# EAGLE schematic OOBDpiCAN (EAGLE 7.2.0)

## Sheet 1 of 3
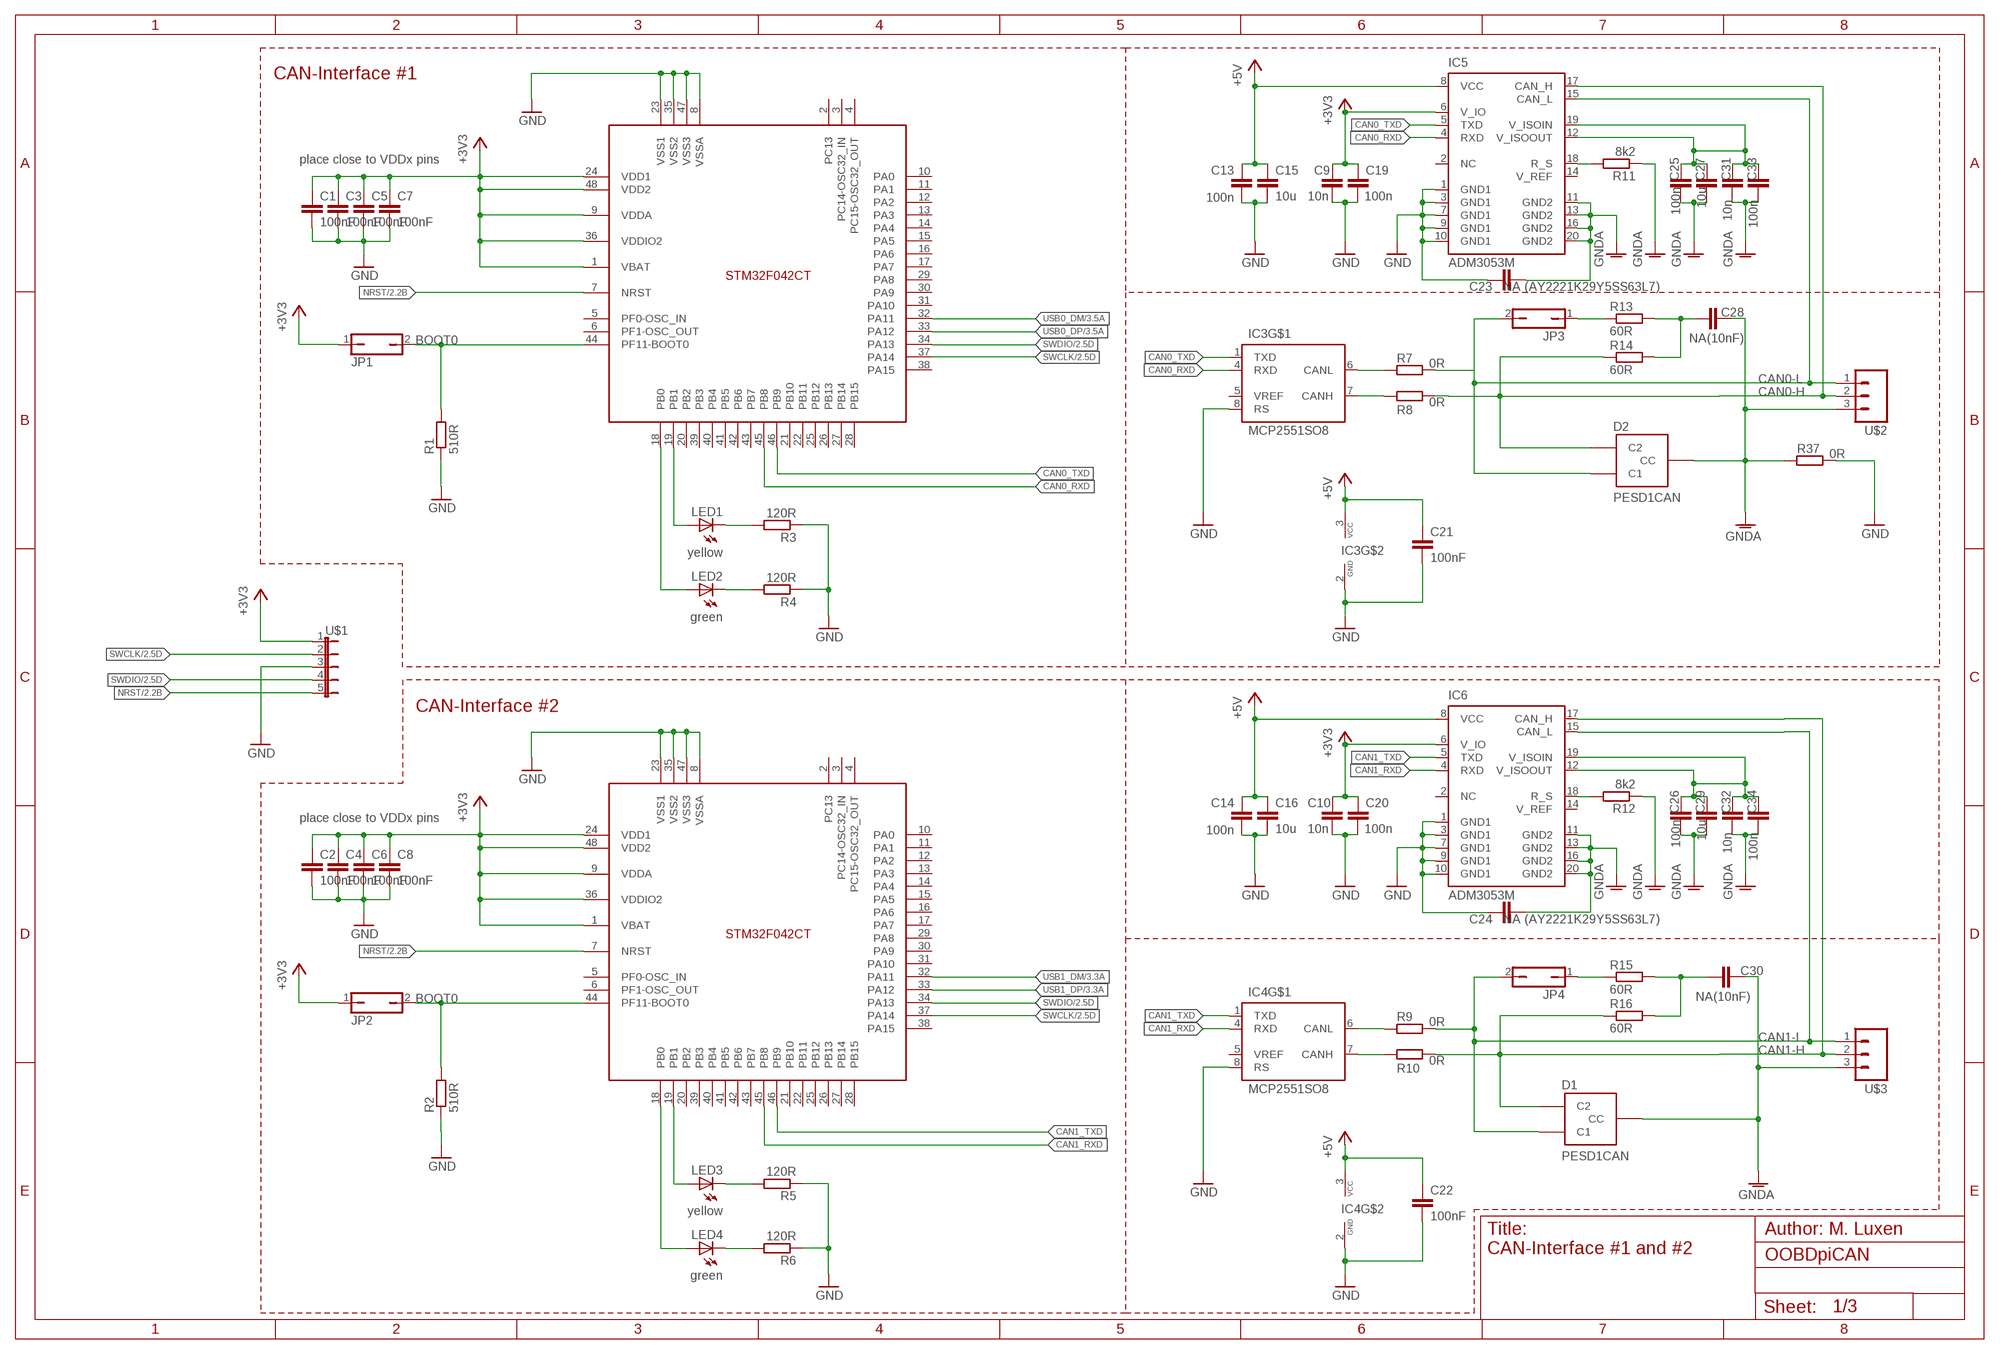
[diagram p0: schematic, sheet 1]

### Parts
C1  100nF  C-EUC0603  [C0603]
C2  100nF  C-EUC0603  [C0603]
C3  100nF  C-EUC0603  [C0603]
C4  100nF  C-EUC0603  [C0603]
C5  100nF  C-EUC0603  [C0603]
C6  100nF  C-EUC0603  [C0603]
C7  100nF  C-EUC0603  [C0603]
C8  100nF  C-EUC0603  [C0603]
C9  10n  C-EUC0603K  [C0603K]
C10  10n  C-EUC0603K  [C0603K]
C13  100n  C-EUC0603K  [C0603K]
C14  100n  C-EUC0603K  [C0603K]
C15  10u  C-EUC0805K  [C0805K]
C16  10u  C-EUC0805K  [C0805K]
C19  100n  C-EUC0603K  [C0603K]
C20  100n  C-EUC0603K  [C0603K]
C21  100nF  C-EUC0603  [C0603]
C22  100nF  C-EUC0603  [C0603]
C23  NA (AY2221K29Y5SS63L7)  C-EU075-032X103  [C075-032X103]
C24  NA (AY2221K29Y5SS63L7)  C-EU075-032X103  [C075-032X103]
C25  100n  C-EUC0805K  [C0805K]
C26  100n  C-EUC0805K  [C0805K]
C27  10u  C-EUC0805K  [C0805K]
C28  NA(10nF)  C-EUC0603  [C0603]
C29  10u  C-EUC0805K  [C0805K]
C30  NA(10nF)  C-EUC0603  [C0603]
C31  10n  C-EUC0805K  [C0805K]
C32  10n  C-EUC0805K  [C0805K]
C33  100n  C-EUC0805K  [C0805K]
C34  100n  C-EUC0805K  [C0805K]
D1  PESD1CAN  [SOT23]
D2  PESD1CAN  [SOT23]
IC1  STM32F042CT  [LQFP48]
IC2  STM32F042CT  [LQFP48]
IC3  MCP2551SO8  [SO08]
IC4  MCP2551SO8  [SO08]
IC5  ADM3053M  [SO20W]
IC6  ADM3053M  [SO20W]
JP1  JP1Q  [JP1]
JP2  JP1Q  [JP1]
JP3  JP1Q  [JP1]
JP4  JP1Q  [JP1]
LED1  yellow  LEDCHIPLED_0805  [CHIPLED_0805]
LED2  green  LEDCHIPLED_0805  [CHIPLED_0805]
LED3  yellow  LEDCHIPLED_0805  [CHIPLED_0805]
LED4  green  LEDCHIPLED_0805  [CHIPLED_0805]
R1  510R  R-EU_R0603  [R0603]
R2  510R  R-EU_R0603  [R0603]
R3  120R  R-EU_R0603  [R0603]
R4  120R  R-EU_R0603  [R0603]
R5  120R  R-EU_R0603  [R0603]
R6  120R  R-EU_R0603  [R0603]
R7  0R  R-EU_0207/10  [0207/10]
R8  0R  R-EU_0207/10  [0207/10]
R9  0R  R-EU_0207/10  [0207/10]
R10  0R  R-EU_0207/10  [0207/10]
R11  8k2  R-EU_R0603  [R0603]
R12  8k2  R-EU_R0603  [R0603]
R13  60R  R-EU_R0603  [R0603]
R14  60R  R-EU_R0603  [R0603]
R15  60R  R-EU_R0603  [R0603]
R16  60R  R-EU_R0603  [R0603]
R37  0R  R-EU_0207/10  [0207/10]
U$1  JP5E  [JP5]
U$2  M03  [SCREWTERMINAL-3.5MM-3]
U$3  M03  [SCREWTERMINAL-3.5MM-3]

### Nets
+3V3: C1.1 C2.1 C3.1 C4.1 C5.1 C6.1 C7.1 C8.1 C9.1 C10.1 C19.1 C20.1 IC1.1(VBAT) IC1.9(VDDA) IC1.24(VDD1) IC1.36(VDDIO2) IC1.48(VDD2) IC2.1(VBAT) IC2.9(VDDA) IC2.24(VDD1) IC2.36(VDDIO2) IC2.48(VDD2) IC5.6(V_IO) IC6.6(V_IO) JP1.1 JP2.1 U$1.1 ; also sheet 2,3
+5V: C13.1 C14.1 C15.1 C16.1 C21.1 C22.1 IC3.3(VCC) IC4.3(VCC) IC5.8(VCC) IC6.8(VCC) ; also sheet 2,3
BOOT0: IC1.44(PF11-BOOT0) IC2.44(PF11-BOOT0) JP1.2 JP2.2 R1.2 R2.2 ; also sheet 2
CAN0-H: D2.2(C2) IC5.17(CAN_H) R8.2 R14.1 U$2.2
CAN0-L: D2.1(C1) IC5.15(CAN_L) JP3.2 R7.2 U$2.1
CAN0_RXD: IC1.45(PB8) IC3.4(RXD) IC5.4(RXD)
CAN0_TXD: IC1.46(PB9) IC3.1(TXD) IC5.5(TXD)
CAN1-H: D1.2(C2) IC6.17(CAN_H) R10.2 R16.1 U$3.2
CAN1-L: D1.1(C1) IC6.15(CAN_L) JP4.2 R9.2 U$3.1
CAN1_RXD: IC2.45(PB8) IC4.4(RXD) IC6.4(RXD)
CAN1_TXD: IC2.46(PB9) IC4.1(TXD) IC6.5(TXD)
GND: C1.2 C2.2 C3.2 C4.2 C5.2 C6.2 C7.2 C8.2 C9.2 C10.2 C13.2 C14.2 C15.2 C16.2 C19.2 C20.2 C21.2 C22.2 C23.1 C24.1 IC1.8(VSSA) IC1.23(VSS1) IC1.35(VSS2) IC1.47(VSS3) IC2.8(VSSA) IC2.23(VSS1) IC2.35(VSS2) IC2.47(VSS3) IC3.2(GND) IC3.8(RS) IC4.2(GND) IC4.8(RS) IC5.1(GND1) IC5.3(GND1) IC5.7(GND1) IC5.9(GND1) IC5.10(GND1) IC6.1(GND1) IC6.3(GND1) IC6.7(GND1) IC6.9(GND1) IC6.10(GND1) R1.1 R2.1 R3.1 R4.1 R5.1 R6.1 R37.2 U$1.3 ; also sheet 2,3
GNDA: C23.2 C24.2 C25.2 C26.2 C27.2 C28.2 C29.2 C30.2 C31.2 C32.2 C33.2 C34.2 D1.3(CC) D2.3(CC) IC5.11(GND2) IC5.13(GND2) IC5.16(GND2) IC5.20(GND2) IC6.11(GND2) IC6.13(GND2) IC6.16(GND2) IC6.20(GND2) R11.1 R12.1 R37.1 U$2.3 U$3.3
N$1: IC5.18(R_S) R11.2
N$12: IC6.18(R_S) R12.2
N$13: C26.1 C29.1 C32.1 C34.1 IC6.12(V_ISOOUT) IC6.19(V_ISOIN)
N$14: IC3.6(CANL) R7.1
N$19: IC3.7(CANH) R8.1
N$22: IC1.19(PB1) LED1.A
N$23: IC1.18(PB0) LED2.A
N$24: LED1.C R3.2
N$25: LED2.C R4.2
N$26: IC4.7(CANH) R10.1
N$27: IC4.6(CANL) R9.1
N$28: JP4.1 R15.1
N$29: IC2.19(PB1) LED3.A
N$30: IC2.18(PB0) LED4.A
N$31: LED3.C R5.2
N$32: LED4.C R6.2
N$48: JP3.1 R13.1
N$49: C30.1 R15.2 R16.2
N$53: C28.1 R13.2 R14.2
N$65: C25.1 C27.1 C31.1 C33.1 IC5.12(V_ISOOUT) IC5.19(V_ISOIN)
NRST: IC1.7(NRST) IC2.7(NRST) U$1.5 ; also sheet 2
SWCLK: IC1.37(PA14) IC2.37(PA14) U$1.2 ; also sheet 2
SWDIO: IC1.34(PA13) IC2.34(PA13) U$1.4 ; also sheet 2
USB0_DM: IC1.32(PA11) ; also sheet 3
USB0_DP: IC1.33(PA12) ; also sheet 3
USB1_DM: IC2.32(PA11) ; also sheet 3
USB1_DP: IC2.33(PA12) ; also sheet 3
Unconnected: IC1.2(PC13) IC1.3(PC14-OSC32_IN) IC1.4(PC15-OSC32_OUT) IC1.5(PF0-OSC_IN) IC1.6(PF1-OSC_OUT) IC1.10(PA0) IC1.11(PA1) IC1.12(PA2) IC1.13(PA3) IC1.14(PA4) IC1.15(PA5) IC1.16(PA6) IC1.17(PA7) IC1.20(PB2) IC1.21(PB10) IC1.22(PB11) IC1.25(PB12) IC1.26(PB13) IC1.27(PB14) IC1.28(PB15) IC1.29(PA8) IC1.30(PA9) IC1.31(PA10) IC1.38(PA15) IC1.39(PB3) IC1.40(PB4) IC1.41(PB5) IC1.42(PB6) IC1.43(PB7) IC2.2(PC13) IC2.3(PC14-OSC32_IN) IC2.4(PC15-OSC32_OUT) IC2.5(PF0-OSC_IN) IC2.6(PF1-OSC_OUT) IC2.10(PA0) IC2.11(PA1) IC2.12(PA2) IC2.13(PA3) IC2.14(PA4) IC2.15(PA5) IC2.16(PA6) IC2.17(PA7) IC2.20(PB2) IC2.21(PB10) IC2.22(PB11) IC2.25(PB12) IC2.26(PB13) IC2.27(PB14) IC2.28(PB15) IC2.29(PA8) IC2.30(PA9) IC2.31(PA10) IC2.38(PA15) IC2.39(PB3) IC2.40(PB4) IC2.41(PB5) IC2.42(PB6) IC2.43(PB7) IC3.5(VREF) IC4.5(VREF) IC5.2(NC) IC5.14(V_REF) IC6.2(NC) IC6.14(V_REF)

### Notes on the sheet
- CAN-Interface #1
- place close to VDDx pins
- CAN-Interface #2
- place close to VDDx pins
- Title: | Author: M. Luxen
- CAN-Interface #1 and #2

## Sheet 2 of 3
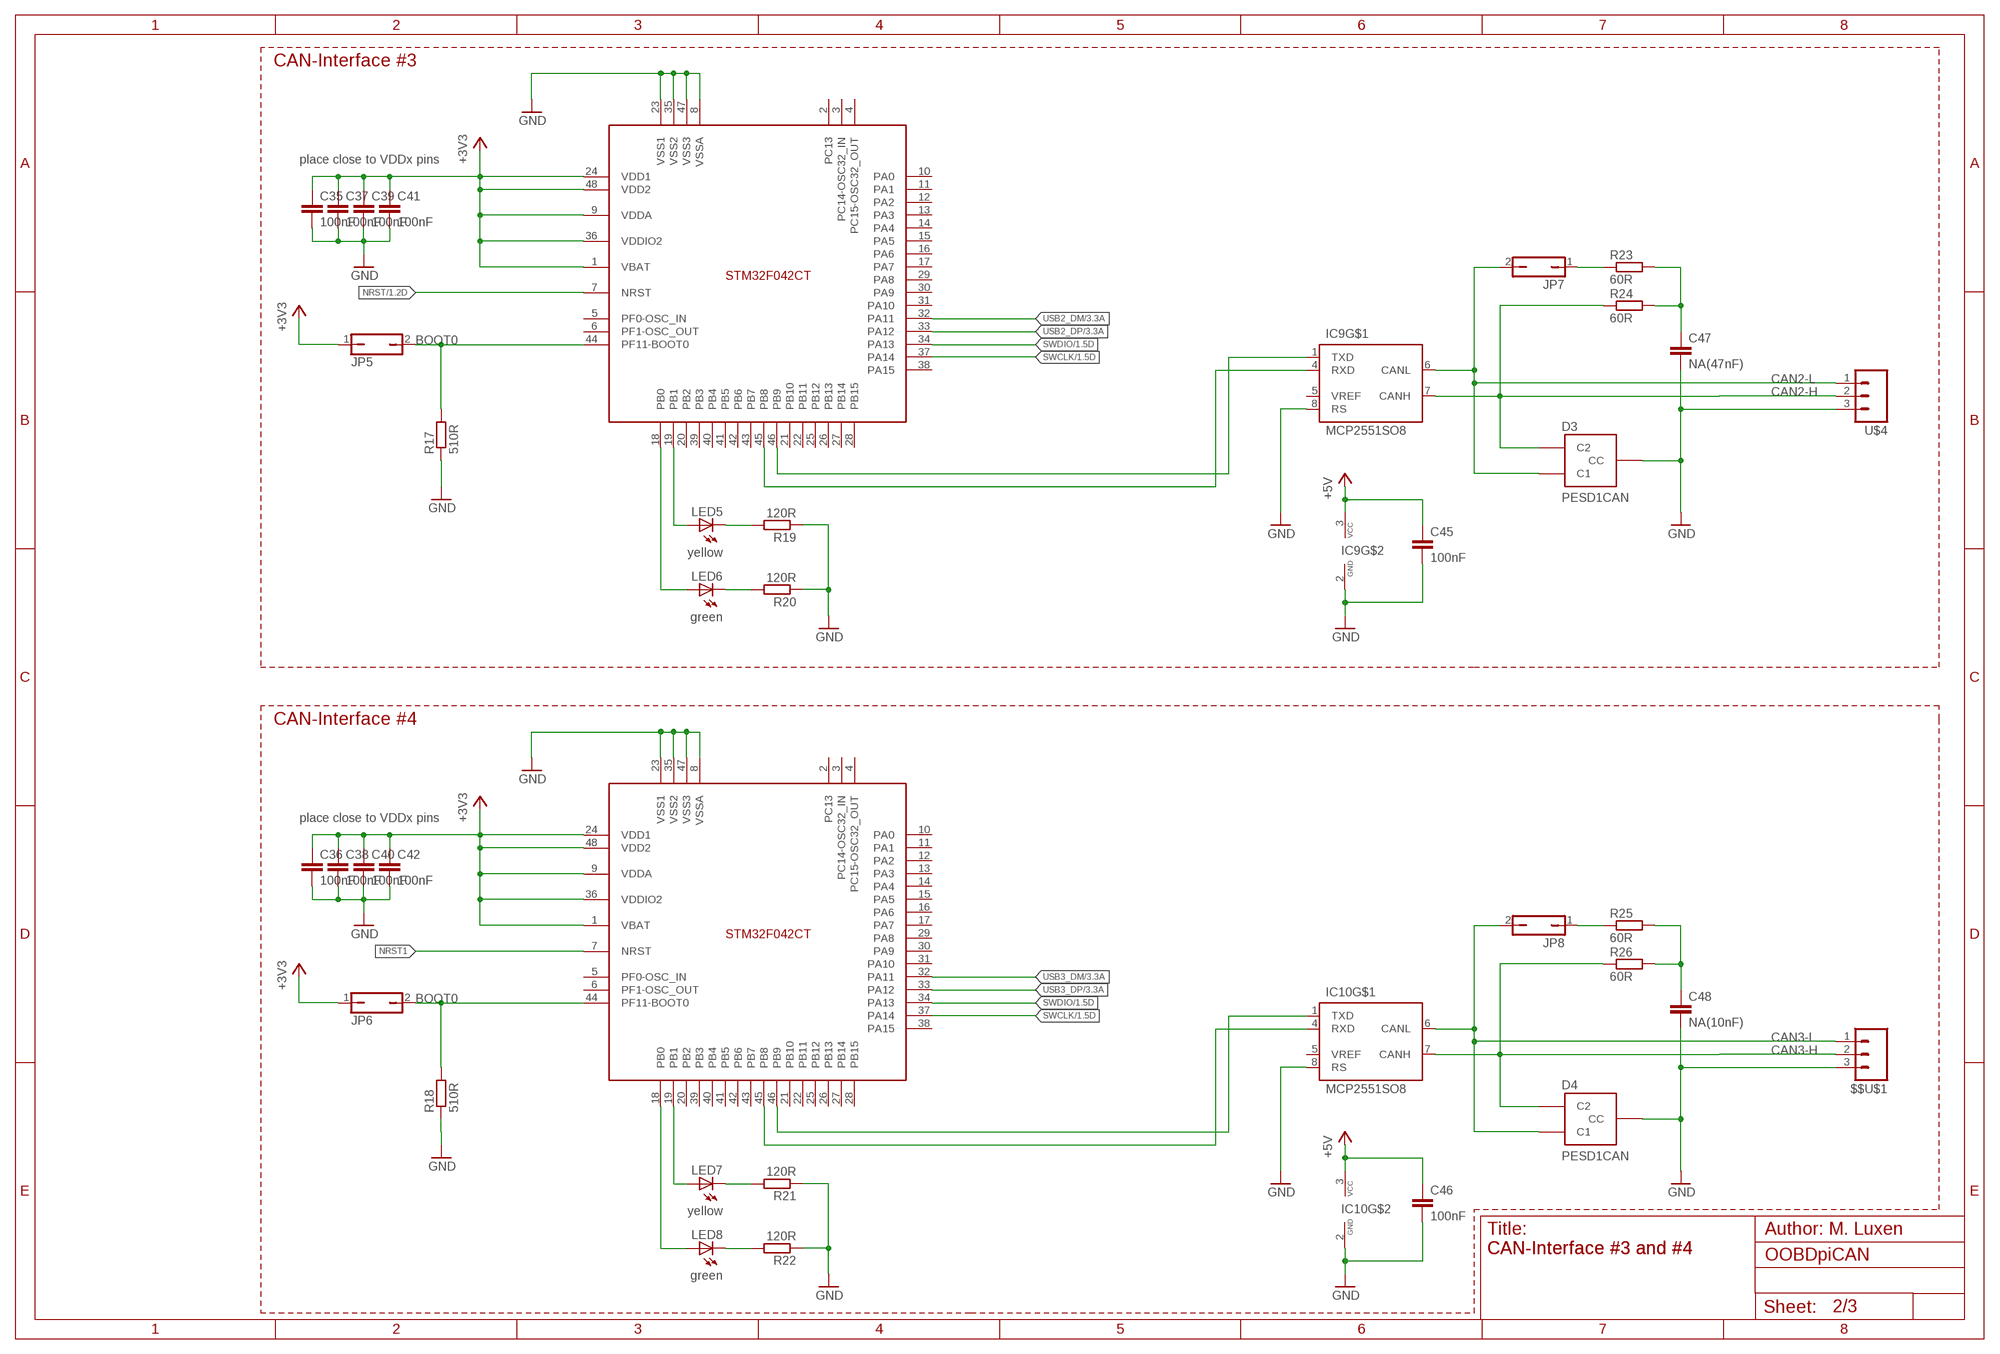
[diagram p1: schematic, sheet 2]

### Parts
$$U$1  M03  [SCREWTERMINAL-3.5MM-3]
C35  100nF  C-EUC0603  [C0603]
C36  100nF  C-EUC0603  [C0603]
C37  100nF  C-EUC0603  [C0603]
C38  100nF  C-EUC0603  [C0603]
C39  100nF  C-EUC0603  [C0603]
C40  100nF  C-EUC0603  [C0603]
C41  100nF  C-EUC0603  [C0603]
C42  100nF  C-EUC0603  [C0603]
C45  100nF  C-EUC0603  [C0603]
C46  100nF  C-EUC0603  [C0603]
C47  NA(47nF)  C-EUC0603  [C0603]
C48  NA(10nF)  C-EUC0603  [C0603]
D3  PESD1CAN  [SOT23]
D4  PESD1CAN  [SOT23]
IC7  STM32F042CT  [LQFP48]
IC8  STM32F042CT  [LQFP48]
IC9  MCP2551SO8  [SO08]
IC10  MCP2551SO8  [SO08]
JP5  JP1Q  [JP1]
JP6  JP1Q  [JP1]
JP7  JP1Q  [JP1]
JP8  JP1Q  [JP1]
LED5  yellow  LEDCHIPLED_0805  [CHIPLED_0805]
LED6  green  LEDCHIPLED_0805  [CHIPLED_0805]
LED7  yellow  LEDCHIPLED_0805  [CHIPLED_0805]
LED8  green  LEDCHIPLED_0805  [CHIPLED_0805]
R17  510R  R-EU_R0603  [R0603]
R18  510R  R-EU_R0603  [R0603]
R19  120R  R-EU_R0603  [R0603]
R20  120R  R-EU_R0603  [R0603]
R21  120R  R-EU_R0603  [R0603]
R22  120R  R-EU_R0603  [R0603]
R23  60R  R-EU_R0603  [R0603]
R24  60R  R-EU_R0603  [R0603]
R25  60R  R-EU_R0603  [R0603]
R26  60R  R-EU_R0603  [R0603]
U$4  M03  [SCREWTERMINAL-3.5MM-3]

### Nets
+3V3: C35.1 C36.1 C37.1 C38.1 C39.1 C40.1 C41.1 C42.1 IC7.1(VBAT) IC7.9(VDDA) IC7.24(VDD1) IC7.36(VDDIO2) IC7.48(VDD2) IC8.1(VBAT) IC8.9(VDDA) IC8.24(VDD1) IC8.36(VDDIO2) IC8.48(VDD2) JP5.1 JP6.1 ; also sheet 1,3
+5V: C45.1 C46.1 IC9.3(VCC) IC10.3(VCC) ; also sheet 1,3
BOOT0: IC7.44(PF11-BOOT0) IC8.44(PF11-BOOT0) JP5.2 JP6.2 R17.2 R18.2 ; also sheet 1
CAN2-H: D3.2(C2) IC9.7(CANH) R24.1 U$4.2
CAN2-L: D3.1(C1) IC9.6(CANL) JP7.2 U$4.1
CAN3-H: $$U$1.2 D4.2(C2) IC10.7(CANH) R26.1
CAN3-L: $$U$1.1 D4.1(C1) IC10.6(CANL) JP8.2
GND: $$U$1.3 C35.2 C36.2 C37.2 C38.2 C39.2 C40.2 C41.2 C42.2 C45.2 C46.2 C47.2 C48.2 D3.3(CC) D4.3(CC) IC7.8(VSSA) IC7.23(VSS1) IC7.35(VSS2) IC7.47(VSS3) IC8.8(VSSA) IC8.23(VSS1) IC8.35(VSS2) IC8.47(VSS3) IC9.2(GND) IC9.8(RS) IC10.2(GND) IC10.8(RS) R17.1 R18.1 R19.1 R20.1 R21.1 R22.1 U$4.3 ; also sheet 1,3
N$4: IC7.19(PB1) LED5.A
N$6: JP7.1 R23.1
N$7: IC7.18(PB0) LED6.A
N$8: LED5.C R19.2
N$9: LED6.C R20.2
N$15: IC8.19(PB1) LED7.A
N$16: IC8.18(PB0) LED8.A
N$17: LED7.C R21.2
N$18: LED8.C R22.2
N$20: C47.1 R23.2 R24.2
N$21: IC8.45(PB8) IC10.4(RXD)
N$54: IC8.46(PB9) IC10.1(TXD)
N$56: IC7.45(PB8) IC9.4(RXD)
N$57: IC7.46(PB9) IC9.1(TXD)
N$59: JP8.1 R25.1
N$63: C48.1 R25.2 R26.2
NRST: IC7.7(NRST) ; also sheet 1
NRST1: IC8.7(NRST)
SWCLK: IC7.37(PA14) IC8.37(PA14) ; also sheet 1
SWDIO: IC7.34(PA13) IC8.34(PA13) ; also sheet 1
USB2_DM: IC7.32(PA11) ; also sheet 3
USB2_DP: IC7.33(PA12) ; also sheet 3
USB3_DM: IC8.32(PA11) ; also sheet 3
USB3_DP: IC8.33(PA12) ; also sheet 3
Unconnected: IC7.2(PC13) IC7.3(PC14-OSC32_IN) IC7.4(PC15-OSC32_OUT) IC7.5(PF0-OSC_IN) IC7.6(PF1-OSC_OUT) IC7.10(PA0) IC7.11(PA1) IC7.12(PA2) IC7.13(PA3) IC7.14(PA4) IC7.15(PA5) IC7.16(PA6) IC7.17(PA7) IC7.20(PB2) IC7.21(PB10) IC7.22(PB11) IC7.25(PB12) IC7.26(PB13) IC7.27(PB14) IC7.28(PB15) IC7.29(PA8) IC7.30(PA9) IC7.31(PA10) IC7.38(PA15) IC7.39(PB3) IC7.40(PB4) IC7.41(PB5) IC7.42(PB6) IC7.43(PB7) IC8.2(PC13) IC8.3(PC14-OSC32_IN) IC8.4(PC15-OSC32_OUT) IC8.5(PF0-OSC_IN) IC8.6(PF1-OSC_OUT) IC8.10(PA0) IC8.11(PA1) IC8.12(PA2) IC8.13(PA3) IC8.14(PA4) IC8.15(PA5) IC8.16(PA6) IC8.17(PA7) IC8.20(PB2) IC8.21(PB10) IC8.22(PB11) IC8.25(PB12) IC8.26(PB13) IC8.27(PB14) IC8.28(PB15) IC8.29(PA8) IC8.30(PA9) IC8.31(PA10) IC8.38(PA15) IC8.39(PB3) IC8.40(PB4) IC8.41(PB5) IC8.42(PB6) IC8.43(PB7) IC9.5(VREF) IC10.5(VREF)

### Notes on the sheet
- CAN-Interface #3
- place close to VDDx pins
- CAN-Interface #4
- place close to VDDx pins
- Title: | Author: M. Luxen
- CAN-Interface #3 and #4 | CAN-Interface #3 and #4

## Sheet 3 of 3
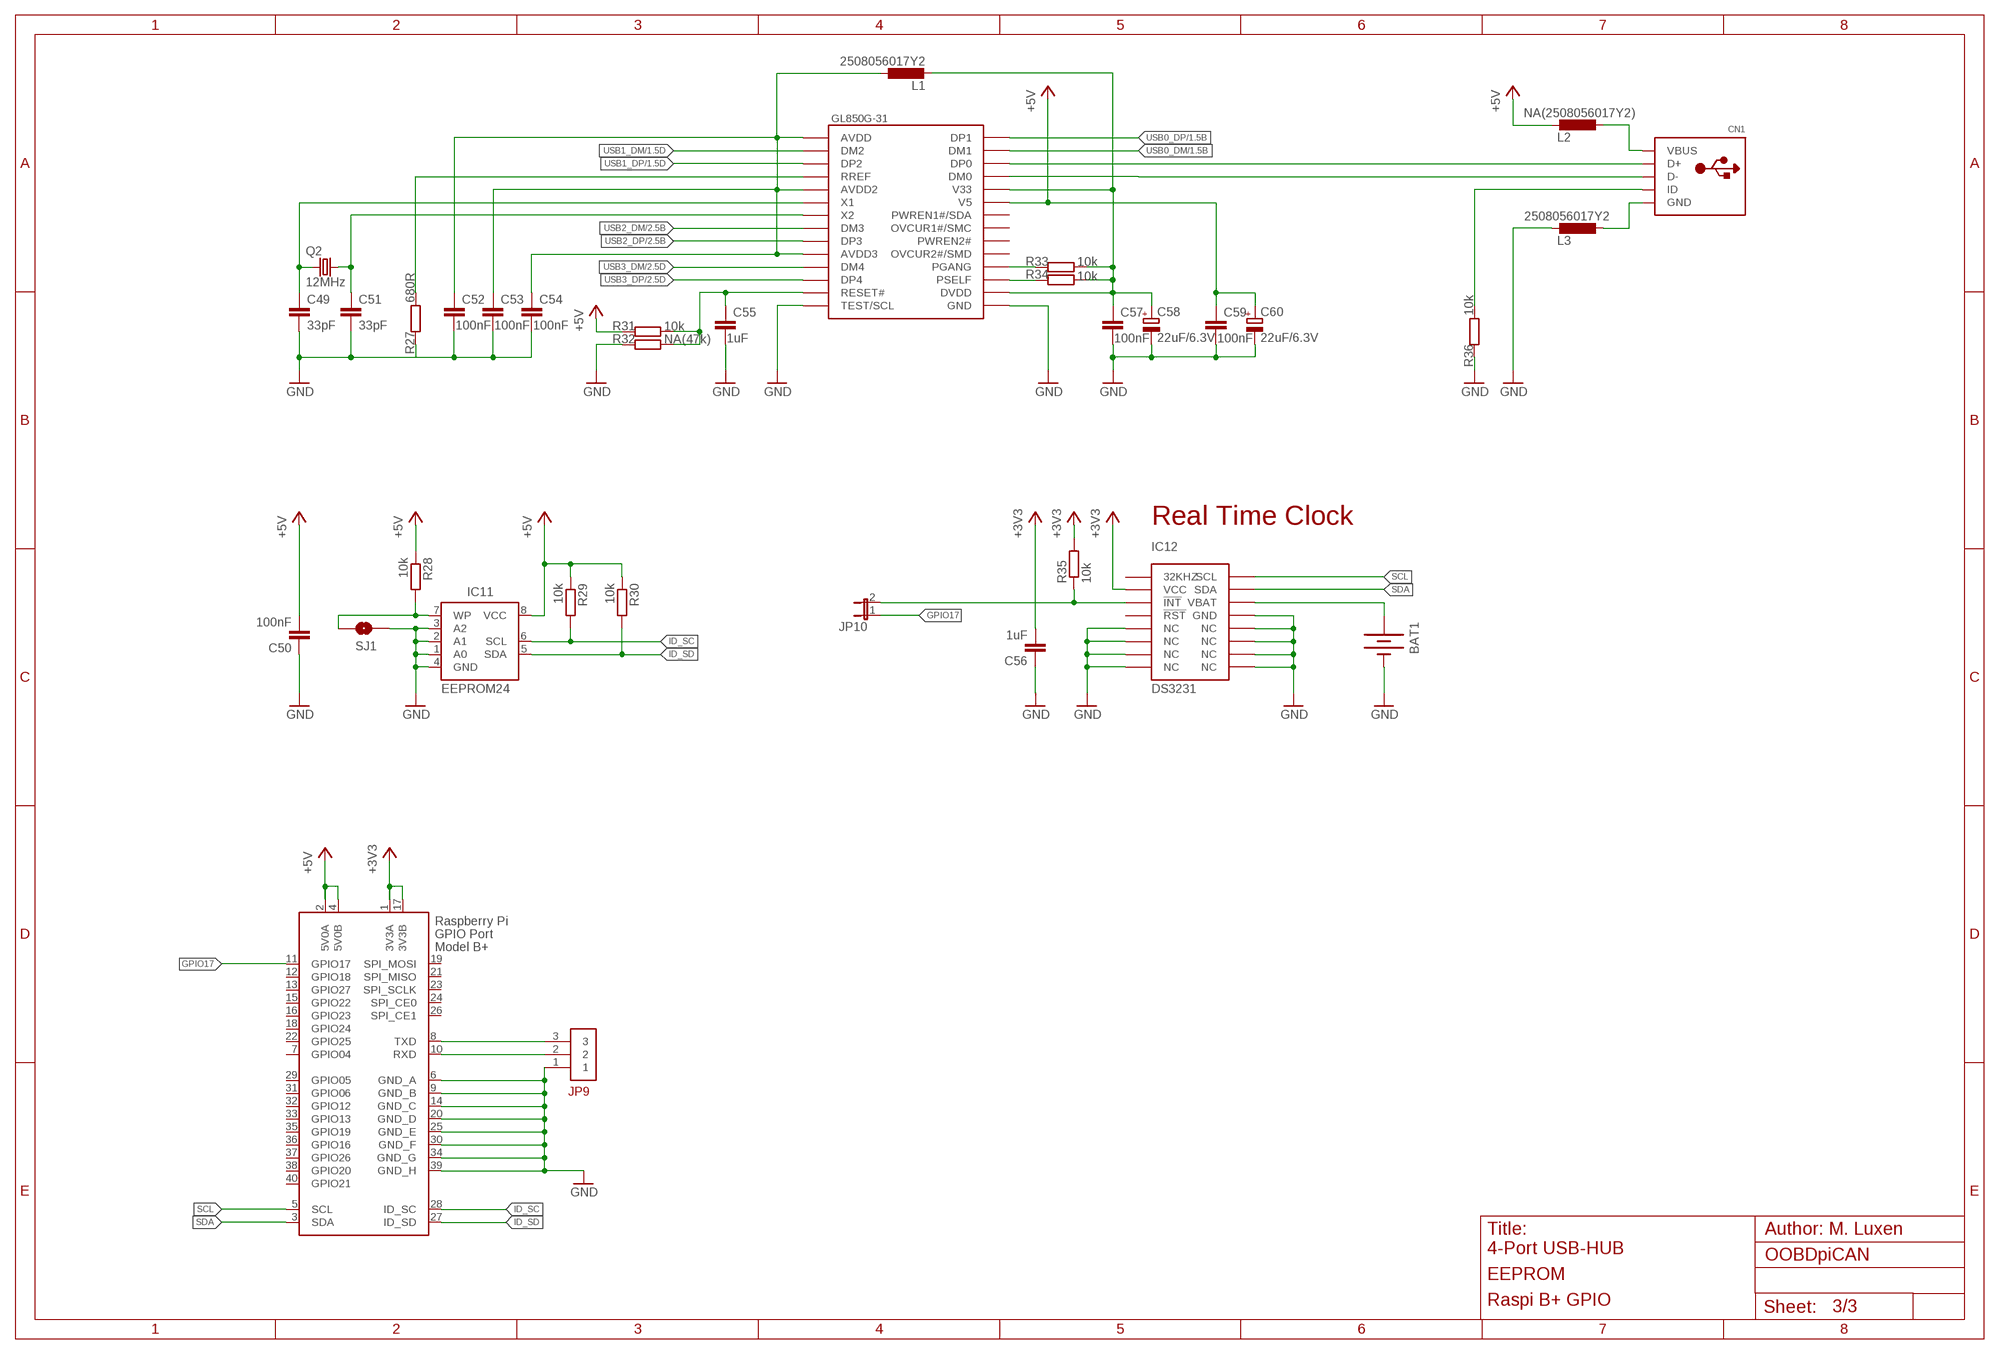
[diagram p2: schematic, sheet 3]

### Parts
BAT1  BATTERY12PTH  [BATTCON_12MM_PTH]
C49  33pF  C-EUC0603  [C0603]
C50  100nF  C-EUC0603  [C0603]
C51  33pF  C-EUC0603  [C0603]
C52  100nF  C-EUC0603  [C0603]
C53  100nF  C-EUC0603  [C0603]
C54  100nF  C-EUC0603  [C0603]
C55  1uF  C-EUC0603  [C0603]
C56  1uF  C-EUC0603  [C0603]
C57  100nF  C-EUC0603  [C0603]
C58  22uF/6.3V  CPOL-EUSMCA  [SMC_A]
C59  100nF  C-EUC0603  [C0603]
C60  22uF/6.3V  CPOL-EUSMCA  [SMC_A]
CN1  USBMOLEX  [USB-MINIB-THM-MOLEX]
IC11  EEPROM24  [SOIC8]
IC12  DS3231  DS3231SOIC-16W  [SOIC-16W]
JP9  MA03-1  [MA03-1]
JP10  JUMPER-2SMD-NO  [SJ_2S-NO]
L1  2508056017Y2  L-EUL0805  [L0805]
L2  NA(2508056017Y2)  L-EUL0805  [L0805]
L3  2508056017Y2  L-EUL0805  [L0805]
Q2  12MHz  CRYSTALSM49  [SM49]
R27  680R  R-EU_R0603  [R0603]
R28  10k  R-EU_R0603  [R0603]
R29  10k  R-EU_R0603  [R0603]
R30  10k  R-EU_R0603  [R0603]
R31  10k  R-EU_R0603  [R0603]
R32  NA(47k)  R-EU_R0603  [R0603]
R33  10k  R-EU_R0603  [R0603]
R34  10k  R-EU_R0603  [R0603]
R35  10k  R-EU_R0603  [R0603]
R36  10k  R-EU_R0603  [R0603]
RPI1  RASPBERRY_HATHAT  [CONNECTOR_B+_SMT_HAT]
SJ1  SOLDERJUMPERTRACE  [SJ_2S-TRACE]
U$5  GL850G-31  [TSSOP28]

### Nets
+3V3: C56.2 IC12.2(VCC) R35.2 RPI1.1(3V3A) RPI1.17(3V3B) ; also sheet 1,2
+5V: C50.2 C59.1 C60.+ IC11.8(VCC) L2.1 R28.1 R29.1 R30.1 R31.1 RPI1.2(5V0A) RPI1.4(5V0B) U$5.23(V5) ; also sheet 1,2
GND: BAT1.GND(-) C49.2 C50.1 C51.2 C52.2 C53.2 C54.2 C55.2 C56.1 C57.2 C58.- C59.2 C60.- IC11.1(A0) IC11.2(A1) IC11.3(A2) IC11.4(GND) IC12.5(NC) IC12.6(NC) IC12.7(NC) IC12.8(NC) IC12.9(NC) IC12.10(NC) IC12.11(NC) IC12.12(NC) IC12.13(GND) JP9.1 L3.1 R27.1 R32.1 R36.1 RPI1.6(GND_A) RPI1.9(GND_B) RPI1.14(GND_C) RPI1.20(GND_D) RPI1.25(GND_E) RPI1.30(GND_F) RPI1.34(GND_G) RPI1.39(GND_H) SJ1.1 U$5.14(TEST/SCL) U$5.15(GND) ; also sheet 1,2
GPIO17: JP10.1 RPI1.11(GPIO17)
ID_SC: IC11.6(SCL) R29.2 RPI1.28(ID_SC)
ID_SD: IC11.5(SDA) R30.2 RPI1.27(ID_SD)
INT-: IC12.3(!INT) JP10.2 R35.1
N$2: C51.1 Q2.2 U$5.7(X2)
N$3: C49.1 Q2.1 U$5.6(X1)
N$5: IC11.7(WP) R28.2 SJ1.2
N$33: C57.1 C58.+ L1.2 R33.2 R34.2 U$5.16(DVDD) U$5.24(V33)
N$34: R33.1 U$5.18(PGANG)
N$35: R34.1 U$5.17(PSELF)
N$36: C55.1 R31.2 R32.2 U$5.13(RESET#)
N$37: CN1.D+ U$5.26(DP0)
N$38: CN1.D- U$5.25(DM0)
N$39: C52.1 C53.1 C54.1 L1.1 U$5.1(AVDD) U$5.5(AVDD2) U$5.10(AVDD3)
N$40: R27.2 U$5.4(RREF)
N$41: CN1.GND L3.2
N$42: CN1.VBUS L2.2
N$44: CN1.ID R36.2
RXD: JP9.2 RPI1.10(RXD)
SCL: IC12.16(SCL) RPI1.5(SCL)
SDA: IC12.15(SDA) RPI1.3(SDA)
TXD: JP9.3 RPI1.8(TXD)
USB0_DM: U$5.27(DM1) ; also sheet 1
USB0_DP: U$5.28(DP1) ; also sheet 1
USB1_DM: U$5.2(DM2) ; also sheet 1
USB1_DP: U$5.3(DP2) ; also sheet 1
USB2_DM: U$5.8(DM3) ; also sheet 2
USB2_DP: U$5.9(DP3) ; also sheet 2
USB3_DM: U$5.11(DM4) ; also sheet 2
USB3_DP: U$5.12(DP4) ; also sheet 2
VBAT: BAT1.VCC@1(+) IC12.14(VBAT)
Unconnected: IC12.1(32KHZ) IC12.4(!RST) RPI1.7(GPIO04) RPI1.12(GPIO18) RPI1.13(GPIO27) RPI1.15(GPIO22) RPI1.16(GPIO23) RPI1.18(GPIO24) RPI1.19(SPI_MOSI) RPI1.21(SPI_MISO) RPI1.22(GPIO25) RPI1.23(SPI_SCLK) RPI1.24(SPI_CE0) RPI1.26(SPI_CE1) RPI1.29(GPIO05) RPI1.31(GPIO06) RPI1.32(GPIO12) RPI1.33(GPIO13) RPI1.35(GPIO19) RPI1.36(GPIO16) RPI1.37(GPIO26) RPI1.38(GPIO20) RPI1.40(GPIO21) U$5.19(OVCUR2#/SMD) U$5.20(PWREN2#) U$5.21(OVCUR1#/SMC) U$5.22(PWREN1#/SDA)

### Notes on the sheet
- Real Time Clock
- Title: | Author: M. Luxen
- 4-Port USB-HUB
- EEPROM
- Raspi B+ GPIO

## Library data of the parts
$$U$1 U$2-U$4 = SparkFun-Connectors:M03: Header 3 Standard 3-pin 0.1" header. Molex polarized connector foot print use with SKU : PRT-08235 with associated crimp pins and housings.
BAT1 = SparkFun:BATTERY: Battery Holders Various common sizes : AA, AAA, 20mm coin cell and 12mm coin cell.
C1-C8 C21 C22 C28 C30 C35-C42 C45-C49 C51-C55 C57 C59 = resistor:C-EU: CAPACITOR, European symbol
C9 C10 C13-C16 C19 C20 C23-C27 C29 C31-C34 C50 C56 = rcl:C-EU: CAPACITOR, European symbol
C58 C60 = rcl:CPOL-EU: POLARIZED CAPACITOR, European symbol
CN1 = adafruit:USB: USB Connectors USBMINIB - Surface Mount Female Mini-B USB Connector 4UConnector: 06564 By microbuilder.eu Thru-hole RA Female Mini-B USB Connector 4UConnector: 18732 By ladyada.net
D1-D4 = Industrialberry:PESD1CAN
IC1 IC2 IC7 IC8 = micro-stm_v3:STM32F042C*T: STM32F042C*T
IC3 IC4 IC9 IC10 = can:MCP2551: CAN Tranceiver Microchip
IC5 IC6 = ADM3053:ADM3053: Signal and Power Isolated CAN Transceiver Analog Devices - Signal and Power Isolated CAN Transceiver with Integrated Isolated DC-to-DC Converter
IC11 = FLYFISH:EEPROM24
IC12 = DS3231_industrialberry:DS3231
JP1-JP8 = jumper:JP1Q: JUMPER
JP9 = MirkoSmartSpaceSolutions:MA03-1: PIN HEADER
JP10 = SparkFun:JUMPER-2: Jumper Basic 0.1" spaced jumper. Use with breakaway headers.
L1-L3 = rcl:L-EU: INDUCTOR, European symbol
LED1-LED8 = led:LED: LED OSRAM: - CHIPLED LG R971, LG N971, LY N971, LG Q971, LY Q971, LO R971, LY R971 LH N974, LH R974 LS Q976, LO Q976, LY Q976 LO Q996 - Hyper CHIPLED LW Q18S LB Q993, LB Q99A, LB R99A - SideLED LS A670, LO A670, LY A670, LG A670, LP A670 LB A673, LV A673, LT A673, LW A673 LH A674 LY A675 LS A676, LA A676, LO A676, LY A676, LW A676 LS A679, LY A679, LG A679 - Hyper Micro SIDELED® LS Y876, LA Y876, LO Y876, LY Y876 LT Y87S - SmartLED LW L88C, LW L88S LB L89C, LB L89S, LG L890 LS L89K, LO L89K, LY L89K LS L896, LA L896, LO L896, LY L896 - TOPLED LS T670, LO T670, LY T670, LG T670, LP T670 LSG T670, LSP T670, LSY T670, LOP T670, LYG T670 LG T671, LOG T671, LSG T671 LB T673, LV T673, LT T673, LW T673 LH T674 LS T676, LA T676, LO T676, LY T676, LB T676, LH T676, LSB T676, LW T676 LB T67C, LV T67C, LT T67C, LS T67K, LO T67K, LY T67K, LW E67C LS E67B, LA E67B, LO E67B, LY E67B, LB E67C, LV E67C, LT E67C LW T67C LS T679, LY T679, LG T679 LS T770, LO T770, LY T770, LG T770, LP T770 LB T773, LV T773, LT T773, LW T773 LH T774 LS E675, LA E675, LY E675, LS T675 LS T776, LA T776, LO T776, LY T776, LB T776 LHGB T686 LT T68C, LB T68C - Hyper Mini TOPLED® LB M676 - Mini TOPLED Santana® LG M470 LS M47K, LO M47K, LY M47K Source: http://www.osram.convergy.de LUXEON: - LUMILED® LXK2-PW12-R00, LXK2-PW12-S00, LXK2-PW14-U00, LXK2-PW14-V00 LXK2-PM12-R00, LXK2-PM12-S00, LXK2-PM14-U00 LXK2-PE12-Q00, LXK2-PE12-R00, LXK2-PE12-S00, LXK2-PE14-T00, LXK2-PE14-U00 LXK2-PB12-K00, LXK2-PB12-L00, LXK2-PB12-M00, LXK2-PB14-N00, LXK2-PB14-P00, LXK2-PB14-Q00 LXK2-PR12-L00, LXK2-PR12-M00, LXK2-PR14-Q00, LXK2-PR14-R00 LXK2-PD12-Q00, LXK2-PD12-R00, LXK2-PD12-S00 LXK2-PH12-R00, LXK2-PH12-S00 LXK2-PL12-P00, LXK2-PL12-Q00, LXK2-PL12-R00 Source: www.luxeon.com KINGBRIGHT: KA-3528ASYC Source: www.kingbright.com
Q2 = crystal:CRYSTAL: CRYSTAL; OC_FARNELL: unknown; OC_NEWARK: unknown
R1-R6 R13-R27 R31-R34 R36 = resistor:R-EU_: RESISTOR, European symbol
R7-R12 R28-R30 R35 R37 = rcl:R-EU_: RESISTOR, European symbol
RPI1 = Connector_B+:RASPBERRY_HAT
SJ1 = SparkFun:SOLDERJUMPER: Solder Jumper Standard SMD solder jumper. Used to automate production. Two varients : Normally Open and Normally Closed are the same, but have different paste layers. NC will have a large amount of paste and should jumper during reflow.
U$1 = jumper:JP5E: JUMPER
U$5 = pimoroni:GL850G-31